# Altium schematic sheet REG5V.SchDoc
size A; SheetNumber: 3; SheetTotal: 10
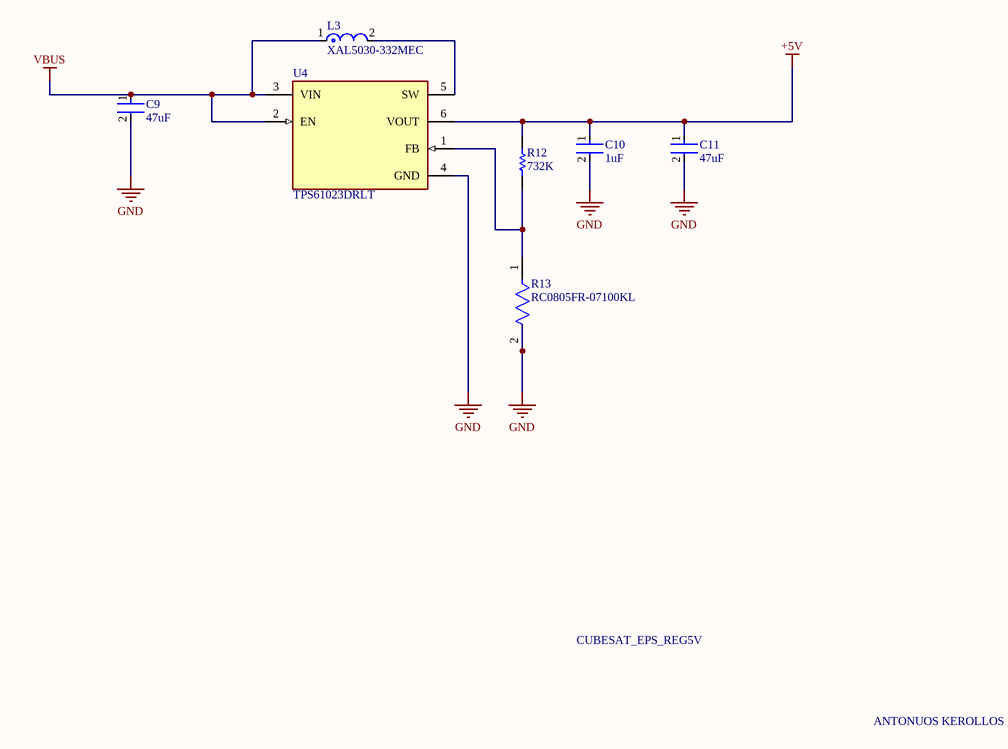
[diagram p0: REG5V.SchDoc]

## Parts
C9  47uF  [FP-GRM32E-0_3-0_2-IPC_A]
C10  1uF  [FP-CL10-IPC_B]
C11  47uF  [FP-GRM32E-0_3-0_2-IPC_A]
L3  XAL5030-332MEC  [FP-XAL5030-MFG]
R12  732K  [RESC2013X60X35ML10T20]
R13  RC0805FR-07100KL  [FP-RC0805-0_6-IPC_C]
U4  TPS61023DRLT  [FP-DRL0006A-MFG]

## Nets
+5V: C10.1 C11.1 R12.1 U4.6(VOUT)
GND: C9.2 C10.2 C11.2 R13.2 U4.4(GND)
VBUS: C9.1 L3.1 U4.2(EN) U4.3(VIN)
NetL3_2: L3.2 U4.5(SW)
NetR12_2: R12.2 R13.1 U4.1(FB)

## Notes on the sheet
- CUBESAT_EPS_REG5V
- ANTONUOS KEROLLOS

## Library data of the parts
C9 C11 = CMP-06035-000110-2: Chip Multilayer Ceramic Capacitors for General Purpose, 1210, 47uF, X6S, 22%, 10%, 16V; Case Code (Metric): 3225; Packaging: Tape and Reel; Mount: Surface Mount; Material: Ceramic; Voltage: 16V; Dielectric: X6S; Depth: 2.5mm; Min Operating Temperature: -55°C; Width: 2.5mm; Height: 2.5mm; Voltage Rating: 16V; Weight: 0.00388oz; Case Code (Imperial): 1210; Max Operating Temperature: 105°C; Capacitance: 47uF; Package Quantity: 1000; Case/Package: 1210; Voltage Rating (DC): 16V; Termination: SMD/SMT; Length: 3.2mm; Thickness: 0.106inch; Tolerance: 10%; Lead Free: Lead Free; REACH SVHC: No SVHC
C10 = CMP-13271-002470-1: Cap Ceramic 1uF 10V X7R ±10% Pad SMD 0603 +125°C T/R; Dielectric: X7R; Width: 0.031inch; Packaging: Tape and Reel; Voltage Rating: 10V; Length: 0.063inch; Capacitance: 1uF; Radiation Hardening: No; Case Code (Metric): 1608; Mount: Surface Mount; Min Operating Temperature: -55°C; Case/Package: 0603; Thickness: 0.035inch; Package Quantity: 1; Tolerance: 10%; Case Code (Imperial): 0603; Max Operating Temperature: 125°C; Height: 0.8mm; Depth: 0.8mm
L3 = CMP-11268-000123-1: Fixed Inductors 3.3uH Shld 20% 8.1A 23.3mOhms AECQ2; Core Material: Composite; Self Resonant Frequency: 28MHz; DC Resistance (DCR): 23.3mR; Test Frequency: 100kHz; Saturation Current: 8.7A; Shielding: Shielded; Max Operating Temperature: 125°C; Lead Free: Contains Lead; Inductance: 3.3uH; Case/Package: SMD/SMT; Package Quantity: 400; Height: 3.1mm; RoHS Compliant: Yes; RMS Current (Irms): 8.1A; Series: XAL5030; Tolerance: 20%; Inductance Tolerance: 20%; REACH SVHC: No SVHC; Termination: SMD/SMT; Mount: Surface Mount; Width: 5.48mm; Max DC Current: 8.1A; Min Operating Temperature: -40°C; Packaging: Tape and Reel; Length: 5.68mm
R12 = CMP-2001-01259-1: Manufacturer: Yageo; Part Number: RC0805FR-07732KL
R13 = CMP-2100-03668-5: RES 100K OHM 1% 1/8W 0805; Power Rating: 125mW; Temperature Coefficient: 100ppm/°C; Voltage Rating (DC): 150V; Resistance: 100kR; Package Quantity: 1; Case/Package: 0805; Lead Pitch: 0.4mm; Case Code (Imperial): 0805; Construction: Rectangular; Number of Terminations: 2; RoHS Compliant: Yes; Max Power Dissipation: 125mW; Tolerance: 1%; Max Operating Temperature: 155°C; Resistance Tolerance: 1%; Lead Free: Lead Free; Packaging: Tape and Reel; Resistor Type: Thick Film; Min Operating Temperature: -55°C; Case Code (Metric): 2012; Series: RC; Technology: THICK FILM; Voltage Rating: 150V; Termination: SMD/SMT; Width: 0.049inch; Number of Pins: 2; Features: Moisture Resistant; Military Standard: Not; Length: 0.079inch; Depth: 1.25mm; Size Code: 0805; Height: 0.024inch
U4 = CMP-04918-000657-1: IC REG BOOST ADJ 3A SOT563